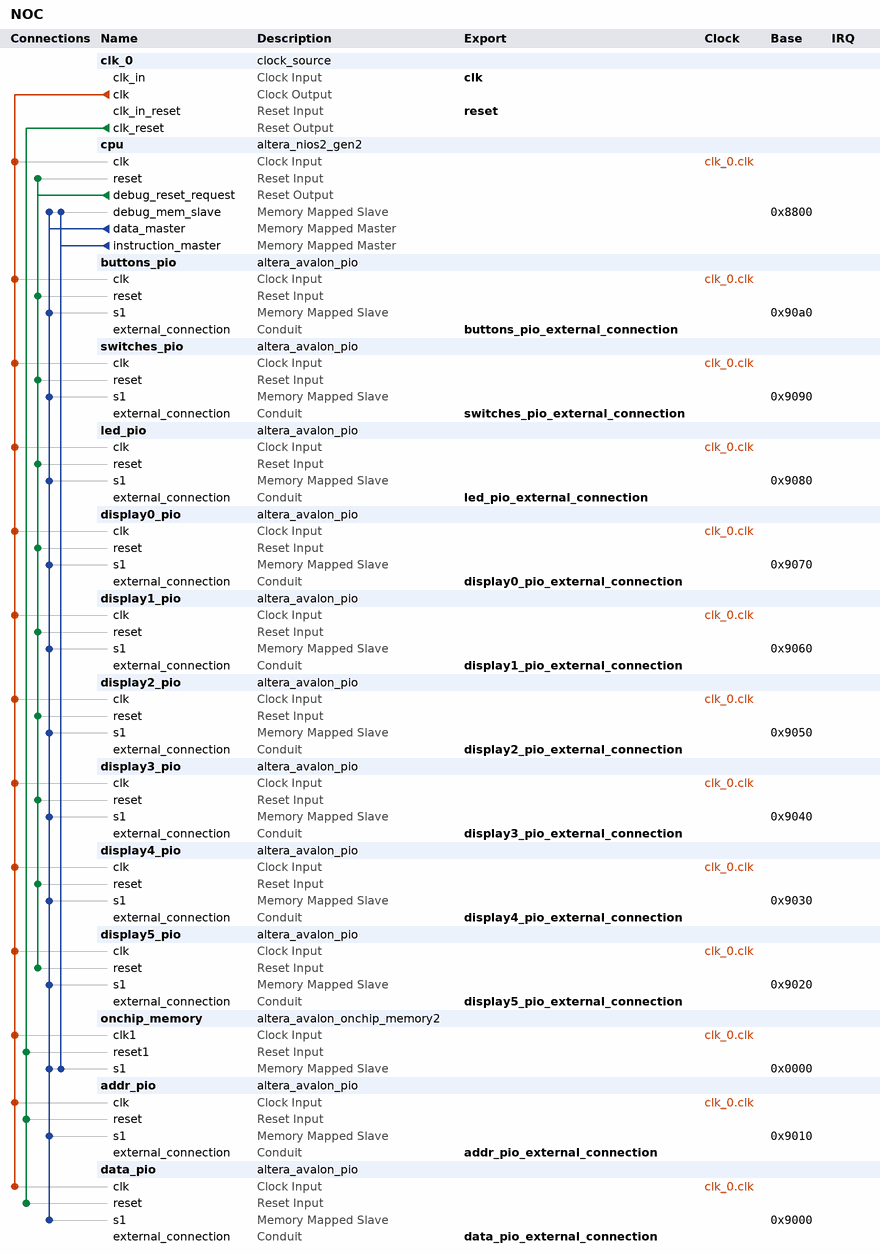
[diagram p0: system contents]
# Platform Designer (Qsys) system NOC, Cyclone V 5CSEMA5F31C6
# Parameters at their usual value, and those the tool derives, are not listed.
package require -exact qsys 18.1
create_system NOC
set_project_property DEVICE_FAMILY {Cyclone V}
set_project_property DEVICE 5CSEMA5F31C6

add_instance clk_0 clock_source 18.1
set_instance_parameter_value clk_0 clockFrequency 50000000

add_instance cpu altera_nios2_gen2 18.1
set_instance_parameter_value cpu cpuID 1
set_instance_parameter_value cpu dcache_size 4096
set_instance_parameter_value cpu exceptionSlave onchip_memory.s1
set_instance_parameter_value cpu icache_size 1024
set_instance_parameter_value cpu impl Fast
set_instance_parameter_value cpu resetSlave onchip_memory.s1

add_instance buttons_pio altera_avalon_pio 18.1
set_instance_parameter_value buttons_pio direction Input
set_instance_parameter_value buttons_pio width 4

add_instance switches_pio altera_avalon_pio 18.1
set_instance_parameter_value switches_pio direction Input
set_instance_parameter_value switches_pio width 10

add_instance led_pio altera_avalon_pio 18.1
set_instance_parameter_value led_pio direction Output
set_instance_parameter_value led_pio width 10

add_instance display0_pio altera_avalon_pio 18.1
set_instance_parameter_value display0_pio direction Output
set_instance_parameter_value display0_pio width 7

add_instance display1_pio altera_avalon_pio 18.1
set_instance_parameter_value display1_pio direction Output
set_instance_parameter_value display1_pio width 7

add_instance display2_pio altera_avalon_pio 18.1
set_instance_parameter_value display2_pio direction Output
set_instance_parameter_value display2_pio width 7

add_instance display3_pio altera_avalon_pio 18.1
set_instance_parameter_value display3_pio direction Output
set_instance_parameter_value display3_pio width 7

add_instance display4_pio altera_avalon_pio 18.1
set_instance_parameter_value display4_pio direction Output
set_instance_parameter_value display4_pio width 7

add_instance display5_pio altera_avalon_pio 18.1
set_instance_parameter_value display5_pio direction Output
set_instance_parameter_value display5_pio width 7

add_instance onchip_memory altera_avalon_onchip_memory2 18.1
set_instance_parameter_value onchip_memory dataWidth 32
set_instance_parameter_value onchip_memory dualPort false
set_instance_parameter_value onchip_memory initMemContent true
set_instance_parameter_value onchip_memory initializationFileName onchip_mem.hex
set_instance_parameter_value onchip_memory memorySize 20480

add_instance addr_pio altera_avalon_pio 18.1
set_instance_parameter_value addr_pio direction InOut
set_instance_parameter_value addr_pio width 8

add_instance data_pio altera_avalon_pio 18.1
set_instance_parameter_value data_pio direction InOut
set_instance_parameter_value data_pio width 32

# connections
add_connection clk_0.clk addr_pio.clk clock
add_connection clk_0.clk buttons_pio.clk clock
add_connection clk_0.clk cpu.clk clock
add_connection clk_0.clk data_pio.clk clock
add_connection clk_0.clk display0_pio.clk clock
add_connection clk_0.clk display1_pio.clk clock
add_connection clk_0.clk display2_pio.clk clock
add_connection clk_0.clk display3_pio.clk clock
add_connection clk_0.clk display4_pio.clk clock
add_connection clk_0.clk display5_pio.clk clock
add_connection clk_0.clk led_pio.clk clock
add_connection clk_0.clk onchip_memory.clk1 clock
add_connection clk_0.clk switches_pio.clk clock
add_connection clk_0.clk_reset addr_pio.reset reset
add_connection clk_0.clk_reset data_pio.reset reset
add_connection clk_0.clk_reset onchip_memory.reset1 reset
add_connection cpu.debug_reset_request buttons_pio.reset reset
add_connection cpu.debug_reset_request cpu.reset reset
add_connection cpu.debug_reset_request display0_pio.reset reset
add_connection cpu.debug_reset_request display1_pio.reset reset
add_connection cpu.debug_reset_request display2_pio.reset reset
add_connection cpu.debug_reset_request display3_pio.reset reset
add_connection cpu.debug_reset_request display4_pio.reset reset
add_connection cpu.debug_reset_request display5_pio.reset reset
add_connection cpu.debug_reset_request led_pio.reset reset
add_connection cpu.debug_reset_request switches_pio.reset reset
add_connection cpu.data_master addr_pio.s1 avalon
set_connection_parameter_value cpu.data_master/addr_pio.s1 baseAddress 0x9010
add_connection cpu.data_master buttons_pio.s1 avalon
set_connection_parameter_value cpu.data_master/buttons_pio.s1 baseAddress 0x90a0
add_connection cpu.data_master cpu.debug_mem_slave avalon
set_connection_parameter_value cpu.data_master/cpu.debug_mem_slave baseAddress 0x8800
add_connection cpu.data_master data_pio.s1 avalon
set_connection_parameter_value cpu.data_master/data_pio.s1 baseAddress 0x9000
add_connection cpu.data_master display0_pio.s1 avalon
set_connection_parameter_value cpu.data_master/display0_pio.s1 baseAddress 0x9070
add_connection cpu.data_master display1_pio.s1 avalon
set_connection_parameter_value cpu.data_master/display1_pio.s1 baseAddress 0x9060
add_connection cpu.data_master display2_pio.s1 avalon
set_connection_parameter_value cpu.data_master/display2_pio.s1 baseAddress 0x9050
add_connection cpu.data_master display3_pio.s1 avalon
set_connection_parameter_value cpu.data_master/display3_pio.s1 baseAddress 0x9040
add_connection cpu.data_master display4_pio.s1 avalon
set_connection_parameter_value cpu.data_master/display4_pio.s1 baseAddress 0x9030
add_connection cpu.data_master display5_pio.s1 avalon
set_connection_parameter_value cpu.data_master/display5_pio.s1 baseAddress 0x9020
add_connection cpu.data_master led_pio.s1 avalon
set_connection_parameter_value cpu.data_master/led_pio.s1 baseAddress 0x9080
add_connection cpu.data_master onchip_memory.s1 avalon
set_connection_parameter_value cpu.data_master/onchip_memory.s1 baseAddress 0x0000
add_connection cpu.data_master switches_pio.s1 avalon
set_connection_parameter_value cpu.data_master/switches_pio.s1 baseAddress 0x9090
add_connection cpu.instruction_master cpu.debug_mem_slave avalon
set_connection_parameter_value cpu.instruction_master/cpu.debug_mem_slave baseAddress 0x8800
add_connection cpu.instruction_master onchip_memory.s1 avalon
set_connection_parameter_value cpu.instruction_master/onchip_memory.s1 baseAddress 0x0000

# exported interfaces
add_interface addr_pio_external_connection conduit end
set_interface_property addr_pio_external_connection EXPORT_OF addr_pio.external_connection
add_interface buttons_pio_external_connection conduit end
set_interface_property buttons_pio_external_connection EXPORT_OF buttons_pio.external_connection
add_interface clk clock sink
set_interface_property clk EXPORT_OF clk_0.clk_in
add_interface data_pio_external_connection conduit end
set_interface_property data_pio_external_connection EXPORT_OF data_pio.external_connection
add_interface display0_pio_external_connection conduit end
set_interface_property display0_pio_external_connection EXPORT_OF display0_pio.external_connection
add_interface display1_pio_external_connection conduit end
set_interface_property display1_pio_external_connection EXPORT_OF display1_pio.external_connection
add_interface display2_pio_external_connection conduit end
set_interface_property display2_pio_external_connection EXPORT_OF display2_pio.external_connection
add_interface display3_pio_external_connection conduit end
set_interface_property display3_pio_external_connection EXPORT_OF display3_pio.external_connection
add_interface display4_pio_external_connection conduit end
set_interface_property display4_pio_external_connection EXPORT_OF display4_pio.external_connection
add_interface display5_pio_external_connection conduit end
set_interface_property display5_pio_external_connection EXPORT_OF display5_pio.external_connection
add_interface led_pio_external_connection conduit end
set_interface_property led_pio_external_connection EXPORT_OF led_pio.external_connection
add_interface reset reset sink
set_interface_property reset EXPORT_OF clk_0.clk_in_reset
add_interface switches_pio_external_connection conduit end
set_interface_property switches_pio_external_connection EXPORT_OF switches_pio.external_connection

set_interconnect_requirement {$system} qsys_mm.clockCrossingAdapter HANDSHAKE
set_interconnect_requirement {$system} qsys_mm.enableEccProtection FALSE
set_interconnect_requirement {$system} qsys_mm.insertDefaultSlave FALSE
set_interconnect_requirement {$system} qsys_mm.maxAdditionalLatency 1

save_system NOC.qsys
